# EasyEDA Pro project FPC.eprj

# Schematic Schematic1
Board Name: Board1; Create Date: 2026-05-17; Page Name: P1; Project Name: FPC; Schematic Name: Schematic1; Update Date: 2026-05-17; Company: 嘉立创EDA; Page Size: A4; Version: V1.0
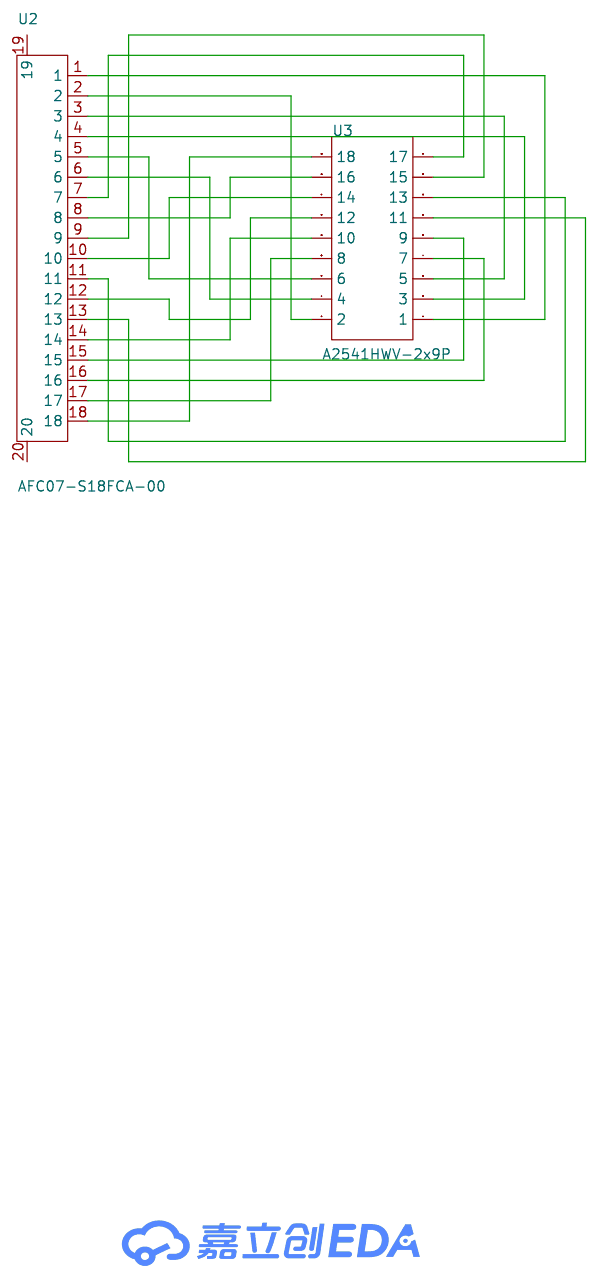
[diagram p0: schematic sheet]

## Parts
U2  AFC07-S18FCA-00  [FPC-SMD_AFC07-S18FCA-00]
U3  A2541HWV-2x9P  [HDR-TH_18P-P2.54-V-F-R2-C9-S2.54-1]

## Library data of the parts
U2 = AFC07-S18FCA-00: LCSC Part Name: 抽屉式 下接 P数:18P 间距:0.5mm; Supplier Part: C262564; Manufacturer: JS(钜硕电子); Supplier Footprint: SMD,P=0.5mm,卧贴; JLCPCB Part Class: Extended Part; Datasheet: https://item.szlcsc.com/datasheet/AFC07-S18FCA-00/253873.html; Supplier: LCSC; Locking Feature: 抽屉式; Contact Type: 下接; Number of Contacts: 18P; Pitch: 0.5mm; Mounting Type: 卧贴; FFC, FCB Thickness: 0.3mm; Height Above Board: 2mm; Contact Material: 铜合金; Contact Plating: 锡
U3 = A2541HWV-2x9P_C5362477: LCSC Part Name: 2x9P 间距:2.54mm 直插; Supplier Part: C5362477; Manufacturer: CJT(长江连接器); Supplier Footprint: 插件,P=2.54mm; JLCPCB Part Class: Extended Part; Datasheet: https://item.szlcsc.com/datasheet/A2541HWV-2x9P/6187990.html; Supplier: LCSC; Holes Structure: 2x9P; Pitch: 2.54mm; Row Spacing: 2.54mm; Circular Hole / Square Hole: 方孔; Mounting Type: 直插; Number of Rows: 双排; Number of Positions: 18P; Current Rating: 3A; Voltage Rating (Max): 250V; Holes Direction: 顶部; Insulation Height: 8.5mm; Contact Material: 黄铜; Contact Plating: 金; Operating Temperature: -40℃~+105℃; PIN Length: 3.2mm

## Nets
$1N1282: U2.1 U3.1
$1N1327: U2.4 U3.3
$1N1333: U2.6 U3.4
$1N1339: U2.3 U3.5
$1N1345: U2.5 U3.6
$1N1351: U2.16 U3.7
$1N1357: U2.17 U3.8
$1N1364: U2.15 U3.9
$1N1373: U2.14 U3.10
$1N1382: U2.7 U3.17
$1N1394: U2.18 U3.18
$1N1426: U2.8 U3.16
$1N1435: U2.10 U3.14
$1N1441: U2.12 U3.12
$1N1475: U2.9 U3.15
$1N1483: U2.11 U3.13
$1N1491: U2.13 U3.11
$1N2513: U2.2 U3.2

Not connected (* = marked no-connect by the designer): U2 19 20

# Board PCB1
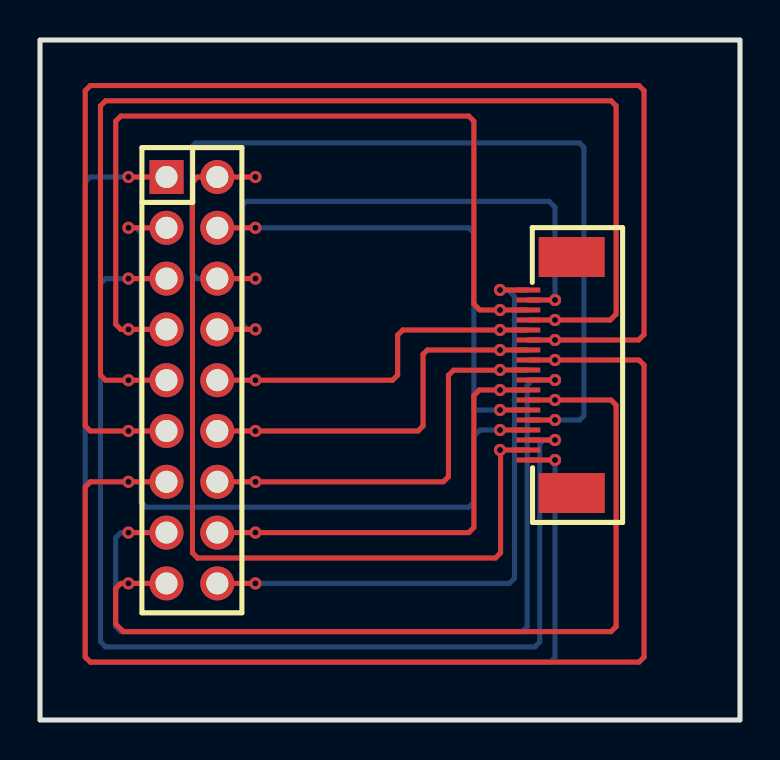
[diagram p1: board, top side]
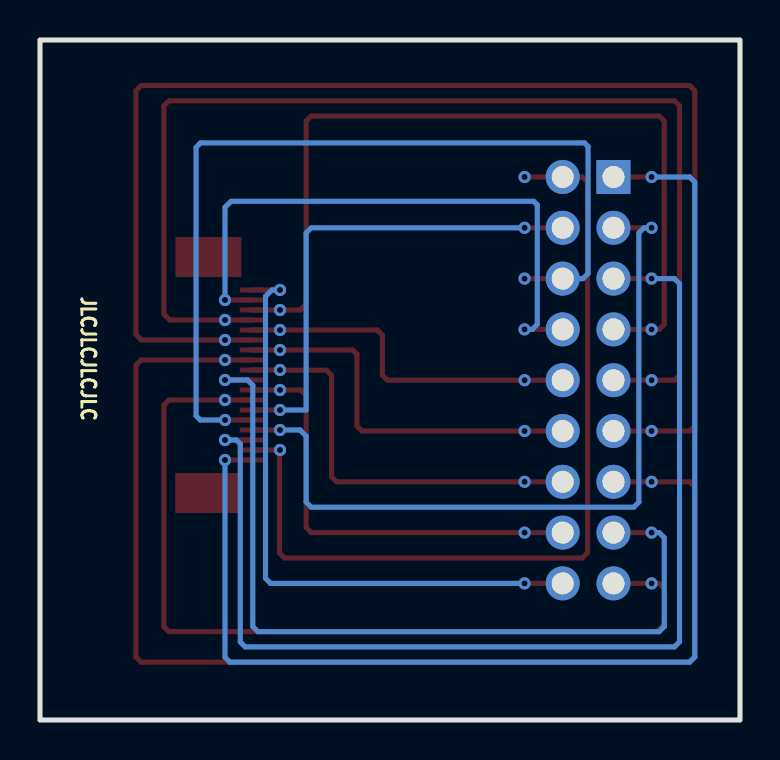
[diagram p2: board, bottom side, seen from below]

Outline 35 x 34 mm; copper layers: Top Layer, Bottom Layer. Coordinates in mm from the lower left corner of the outline.
Outline path: rectangle 0,34 35,0
Stack: Top Layer 0.035mm / Dielectric1 1.51mm FR4 er 4.5 / Bottom Layer 0.035mm

## Design rules (mm)
template: JLCPCB Capability(Two Layers Board)
spacing copperThickness1oz (default): track to track 0.102, other pairs 0.152 to 0.3
spacing copperThickness2oz: track to track 0.203, other pairs 0.152 to 0.3
track width copperThickness1oz (default): min 0.127, default 0.254, max 2.54
track width copperThickness2oz: min 0.203, default 0.254, max 2.54
differential pair differentialPair (default): width min 0.127, default 0.254, max 2.54; gap min 0.152, default 0.152
via viaSize (default): diameter min 0.5, default 0.61, max 10; hole min 0.3, default 0.305, max 6.3

## Placement (name value [footprint] x y rotation side)
U2  AFC07-S18FCA-00  [FPC-SMD_AFC07-S18FCA-00]  25.5 17.25 90 top
U3  A2541HWV-2x9P  [HDR-TH_18P-P2.54-V-F-R2-C9-S2.54-1]  7.6 16.99 270 top

## Footprints (pads in the part's own frame, mm; a bottom-side part is the same pattern mirrored in y, then rotated)
FPC-SMD_AFC07-S18FCA-00
  rect 0.25x1.2 smd: 1(-4.25,1.089) 2(-3.75,1.089) 3(-3.25,1.089) 4(-2.75,1.089) 5(-2.25,1.089) 6(-1.75,1.089) 7(-1.25,1.089) 8(-0.75,1.089) 9(-0.25,1.089) 10(0.25,1.089) 11(0.75,1.089) 12(1.25,1.089) 13(1.75,1.089) 14(2.25,1.089) 15(2.75,1.089) 16(3.25,1.089) 17(3.75,1.089) 18(4.25,1.089)
  rect 2x3.3 smd: 19(5.901,-1.081) 20(-5.901,-1.089)
HDR-TH_18P-P2.54-V-F-R2-C9-S2.54-1
  rect 1.7x1.7 hole 1.1: 1(-10.16,-1.27)
  round 1.7 hole 1.1: 2(-10.16,1.27) 3(-7.62,-1.27) 4(-7.62,1.27) 5(-5.08,-1.27) 6(-5.08,1.27) 7(-2.54,-1.27) 8(-2.54,1.27) 9(0,-1.27) 10(0,1.27) 11(2.54,-1.27) 12(2.54,1.27) 13(5.08,-1.27) 14(5.08,1.27) 15(7.62,-1.27) 16(7.62,1.27) 17(10.16,-1.27) 18(10.16,1.27)

## Nets
As in the schematic.

Pads without a net: U2 19 20

## Via types
v1: diameter 0.61, hole 0.305, Top Layer to Bottom Layer, 36 vias

## Routing (per net, layer and track width the routed paths; a pad name or vN(x,y) marks a point on that pad's centre or on a via; arc(x,y) is an arc through that point)
$1N1282: length 62.8
  Top Layer w0.254: v1(25.75,13) U2.1 ; v1(4.42,27.15) U3.1
  Bottom Layer w0.254: v1(4.42,27.15) 2.52,27.15 2.26,26.9 2.26,3.15 2.52,2.89 25.5,2.89 25.75,3.14 v1(25.75,13)
$1N1327: length 39.1
  Top Layer w0.254: v1(4.42,24.61) U3.3 ; v1(23,14.5) U2.4
  Bottom Layer w0.254: v1(23,14.5) 22,14.5 21.69,14.2 21.69,10.89 21.44,10.64 5.31,10.64 5.06,10.89 5.06,24.36 4.8,24.61 v1(4.42,24.61)
$1N1333: length 24.5
  Top Layer w0.254: U3.4 v1(10.77,24.61) ; v1(23,15.5) U2.6
  Bottom Layer w0.254: v1(23,15.5) 21.69,15.5 21.69,24.36 21.44,24.61 v1(10.77,24.61)
$1N1339: length 55.6
  Top Layer w0.254: v1(4.42,22.07) U3.5 ; v1(25.75,14) U2.3
  Bottom Layer w0.254: v1(4.42,22.07) 3.28,22.07 3.02,21.82 3.02,3.91 3.28,3.66 24.74,3.66 24.99,3.9 24.99,13.81 25.18,14 v1(25.75,14)
$1N1345: length 45.7
  Top Layer w0.254: v1(25.75,15) U2.5 ; U3.6 v1(10.77,22.07)
  Bottom Layer w0.254: U3.6 7.85,22.07 7.6,22.32 7.6,28.67 7.78,28.85 26.97,28.85 27.2,28.63 27.2,15.21 26.98,15 v1(25.75,15)
$1N1351: length 42.9
  Top Layer w0.254: U2.16 v1(23,20.5) 21.99,20.5 21.69,20.8 21.69,29.94 21.44,30.2 4.04,30.2 3.79,29.94 3.79,19.78 4.04,19.53 v1(4.42,19.53) U3.7
$1N1357: length 30.4
  Top Layer w0.254: v1(10.77,19.53) U3.8 ; v1(25.75,21) U2.17
  Bottom Layer w0.254: v1(10.77,19.53) 10.39,19.53 10.14,19.78 10.14,25.75 10.32,25.93 25.45,25.93 25.75,25.63 v1(25.75,21)
$1N1364: length 57.8
  Top Layer w0.254: U2.15 v1(25.75,20) 28.51,20 28.81,20.29 28.81,30.71 28.55,30.96 3.28,30.96 3.02,30.71 3.02,17.24 3.28,16.99 v1(4.42,16.99) U3.9
$1N1373: length 17.8
  Top Layer w0.254: U3.10 v1(10.77,16.99) 17.63,16.99 17.88,17.24 17.88,19.25 18.14,19.5 v1(23,19.5) U2.14
$1N1382: length 45.3
  Top Layer w0.254: U2.7 v1(25.75,16) 28.55,16 28.81,15.75 28.81,4.67 28.55,4.42 4.17,4.42 3.79,4.8 3.79,6.58 4.04,6.83 v1(4.42,6.83) U3.17
$1N1394: length 31.3
  Top Layer w0.254: U3.18 v1(10.77,6.83) ; v1(23,21.5) U2.18
  Bottom Layer w0.254: v1(23,21.5) 23.41,21.5 23.72,21.18 23.72,7.08 23.47,6.83 v1(10.77,6.83)
$1N1426: length 22.4
  Top Layer w0.254: U2.8 v1(23,16.5) 21.97,16.5 21.69,16.23 21.69,9.62 21.44,9.37 v1(10.77,9.37) U3.16
$1N1435: length 20.8
  Top Layer w0.254: U2.10 v1(23,17.5) 22.99,17.49 20.68,17.49 20.42,17.24 20.42,12.16 20.17,11.91 v1(10.77,11.91) U3.14
$1N1441: length 19.3
  Top Layer w0.254: U2.12 v1(23,18.5) 19.37,18.5 19.15,18.29 19.15,14.7 18.9,14.45 v1(10.77,14.45) U3.12
$1N1475: length 42.8
  Top Layer w0.254: v1(4.42,9.37) U3.15 ; v1(25.75,17) U2.9
  Bottom Layer w0.254: v1(4.42,9.37) 4.04,9.37 3.79,9.12 3.79,4.67 4.04,4.42 24.11,4.42 24.36,4.67 24.36,16.74 24.62,17 v1(25.75,17)
$1N1483: length 61.3
  Top Layer w0.254: U3.13 v1(4.42,11.91) 2.52,11.91 2.26,11.66 2.26,3.15 2.52,2.89 29.95,2.89 30.2,3.15 30.2,17.75 29.95,18 v1(25.75,18) U2.11
$1N1491: length 67.2
  Top Layer w0.254: U3.11 v1(4.42,14.45) 2.52,14.45 2.26,14.7 2.26,31.47 2.52,31.72 29.95,31.72 30.2,31.47 30.2,19.28 29.93,19 v1(25.75,19) U2.13
$1N2513: length 44
  Top Layer w0.254: v1(10.77,27.15) U3.2 7.88,27.15 7.62,26.9 7.62,8.35 7.88,8.1 22.77,8.1 23.03,8.35 23.03,13.47 v1(23,13.5) U2.2

## Text on the board
Bottom Silkscreen Layer: JLCJLCJLCJLC
